# EAGLE design SIDEPANEL3.2test (EAGLE 7.3.0)
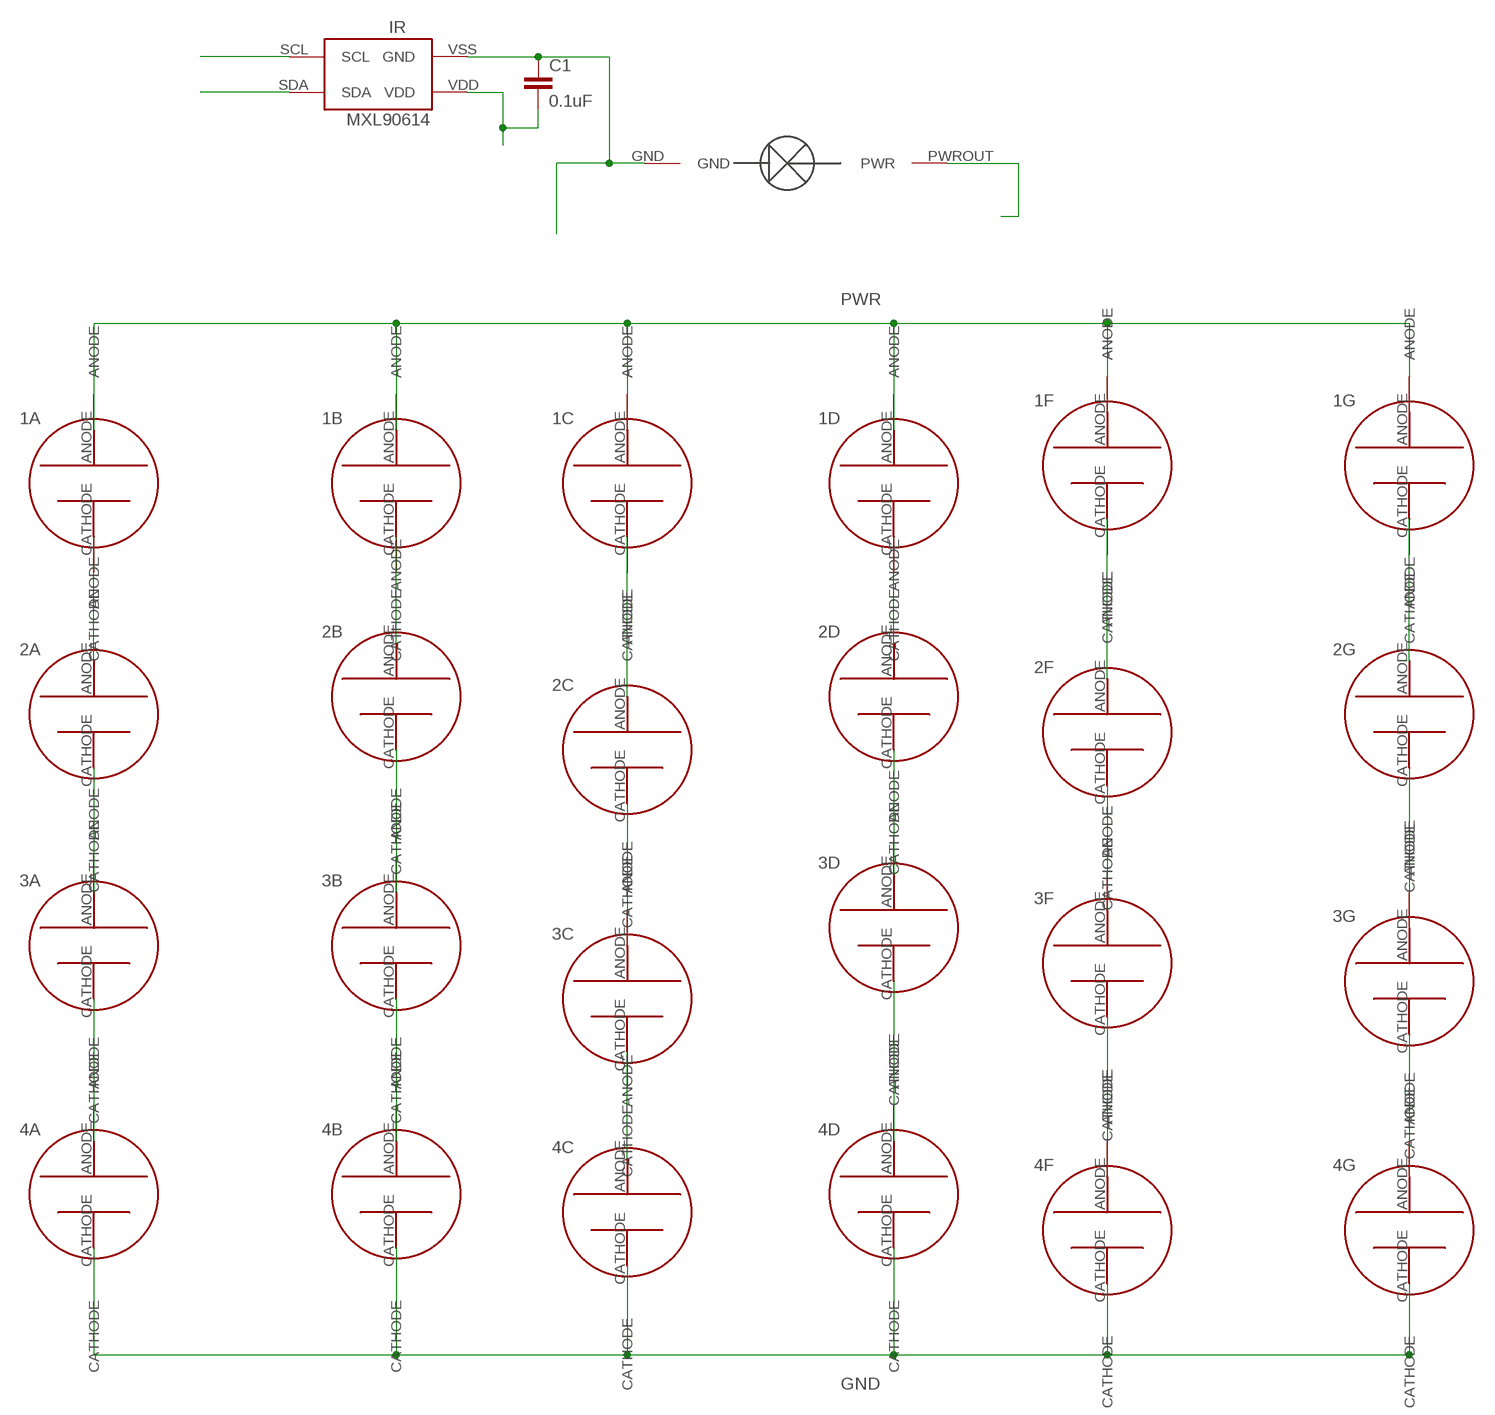
[diagram p0: schematic, sheet 1]

## Parts
1A  NEWSOLARPANEL  [SOLARCELL2]
1B  NEWSOLARPANEL  [SOLARCELL2]
1C  NEWSOLARPANEL  [SOLARCELL2]
1D  NEWSOLARPANEL  [SOLARCELL2]
1F  NEWSOLARPANEL  [SOLARCELL2]
1G  NEWSOLARPANEL  [SOLARCELL2]
2A  NEWSOLARPANEL  [SOLARCELL2]
2B  NEWSOLARPANEL  [SOLARCELL2]
2C  NEWSOLARPANEL  [SOLARCELL2]
2D  NEWSOLARPANEL  [SOLARCELL2]
2F  NEWSOLARPANEL  [SOLARCELL2]
2G  NEWSOLARPANEL  [SOLARCELL2]
3A  NEWSOLARPANEL  [SOLARCELL2]
3B  NEWSOLARPANEL  [SOLARCELL2]
3C  NEWSOLARPANEL  [SOLARCELL2]
3D  NEWSOLARPANEL  [SOLARCELL2]
3F  NEWSOLARPANEL  [SOLARCELL2]
3G  NEWSOLARPANEL  [SOLARCELL2]
4A  NEWSOLARPANEL  [SOLARCELL2]
4B  NEWSOLARPANEL  [SOLARCELL2]
4C  NEWSOLARPANEL  [SOLARCELL2]
4D  NEWSOLARPANEL  [SOLARCELL2]
4F  NEWSOLARPANEL  [SOLARCELL2]
4G  NEWSOLARPANEL  [SOLARCELL2]
C1  0.1uF  CAP0805  [0805]
IR  MXL90620  [MXL90614]
U$1  PHOTODETECTOR  [PHOTODECTORDEVICE2]

## Nets
3V3: C1.2 IR.VDD
GND: 4A.CATHODE 4B.CATHODE 4C.CATHODE 4D.CATHODE 4F.CATHODE 4G.CATHODE C1.1 IR.VSS(GND) U$1.GND
N$1: 2A.CATHODE 3A.ANODE
N$2: 1C.CATHODE 2C.ANODE
N$3: 2B.CATHODE 3B.ANODE
N$4: 2C.CATHODE 3C.ANODE
N$5: 2D.CATHODE 3D.ANODE
N$6: 3C.CATHODE 4C.ANODE
N$8: 2F.CATHODE 3F.ANODE
N$9: 1B.CATHODE 2B.ANODE
N$10: 2G.CATHODE 3G.ANODE
N$11: 3G.CATHODE 4G.ANODE
N$12: 1D.CATHODE 2D.ANODE
N$13: 3F.CATHODE 4F.ANODE
N$15: 3D.CATHODE 4D.ANODE
N$16: 3B.CATHODE 4B.ANODE
N$17: 3A.CATHODE 4A.ANODE
N$18: 1A.CATHODE 2A.ANODE
N$24: 1G.CATHODE 2G.ANODE
N$32: 1F.CATHODE 2F.ANODE
PDOUT: U$1.PWROUT(PWR)
PWR: 1A.ANODE 1B.ANODE 1C.ANODE 1D.ANODE 1F.ANODE 1G.ANODE
SCL: IR.SCL
SDA: IR.SDA

## Library data of the parts
1A 1B 1C 1D 1F 1G 2A 2B 2C 2D 2F 2G 3A 3B 3C 3D 3F 3G 4A 4B 4C 4D 4F 4G = solarcellnew:NEWSOLARPANEL
C1 = CNTRL_BOARD:CAP: Capacitor Standard 0603 ceramic capacitor, and 0.1" leaded capacitor.
IR = CNTRL_BOARD:MXL90620
U$1 = solarcellnew:PHOTODETECTOR

## Board
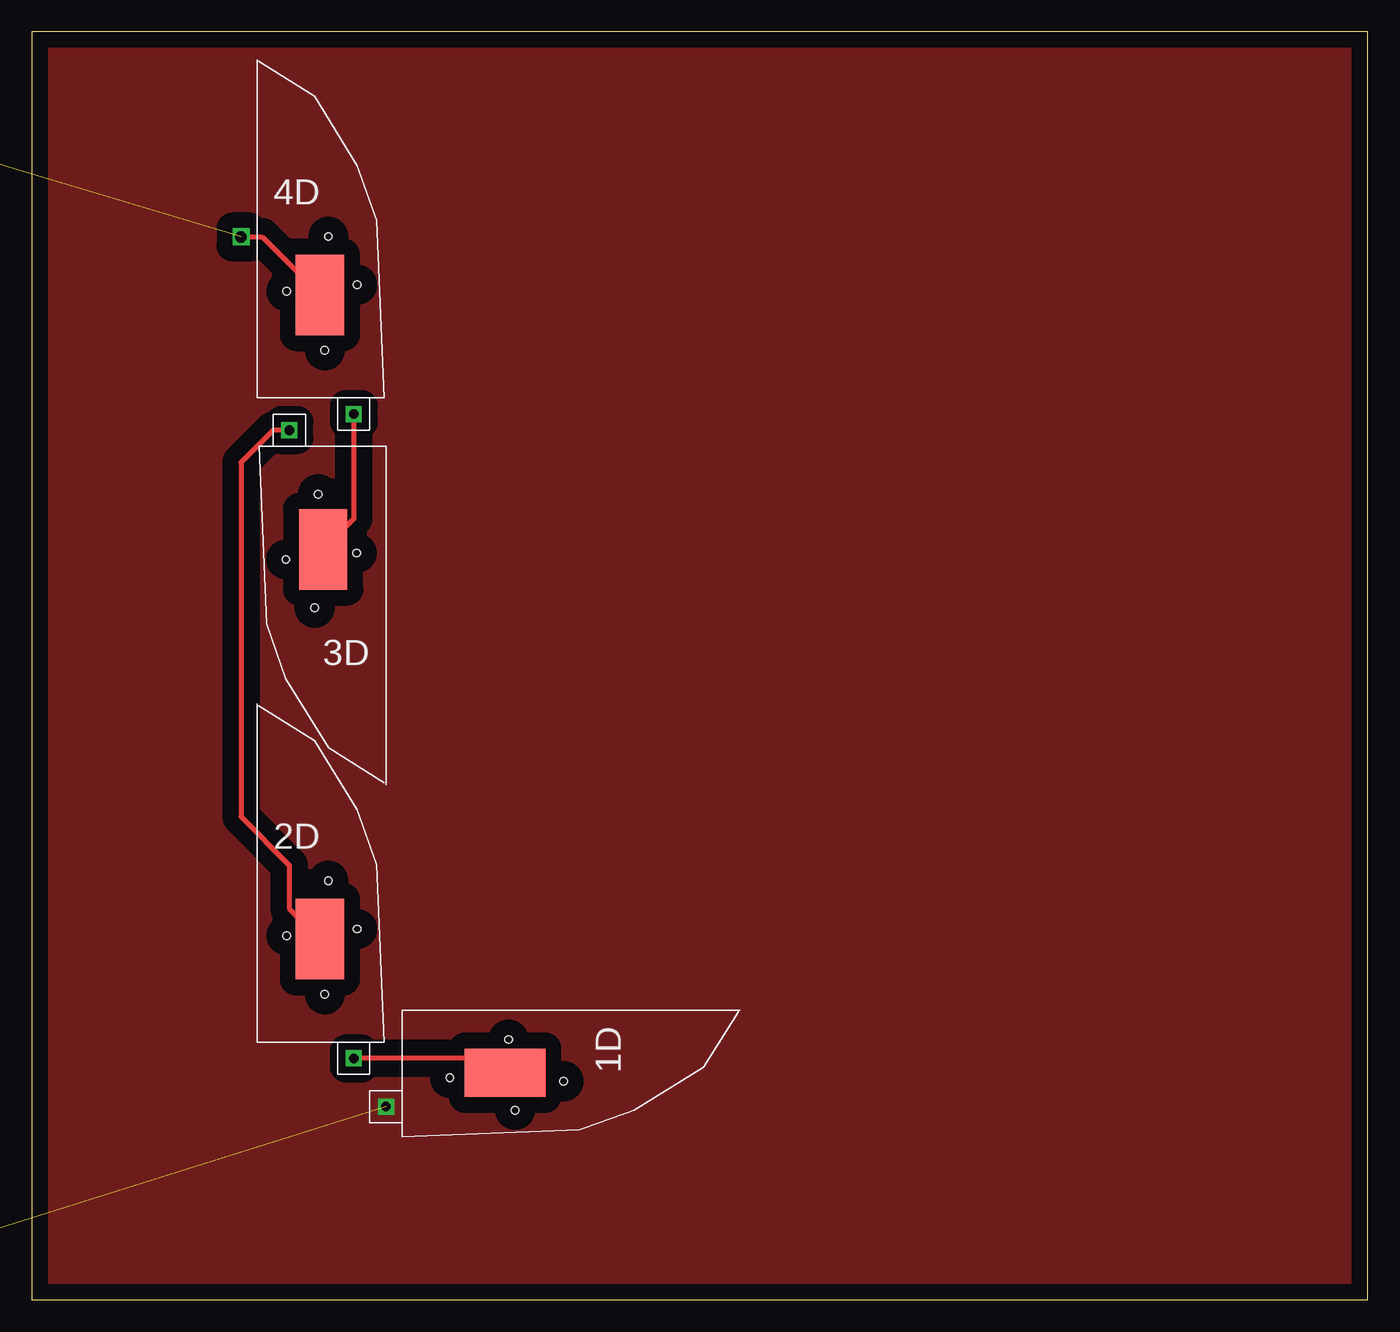
[diagram p1: board, top side]
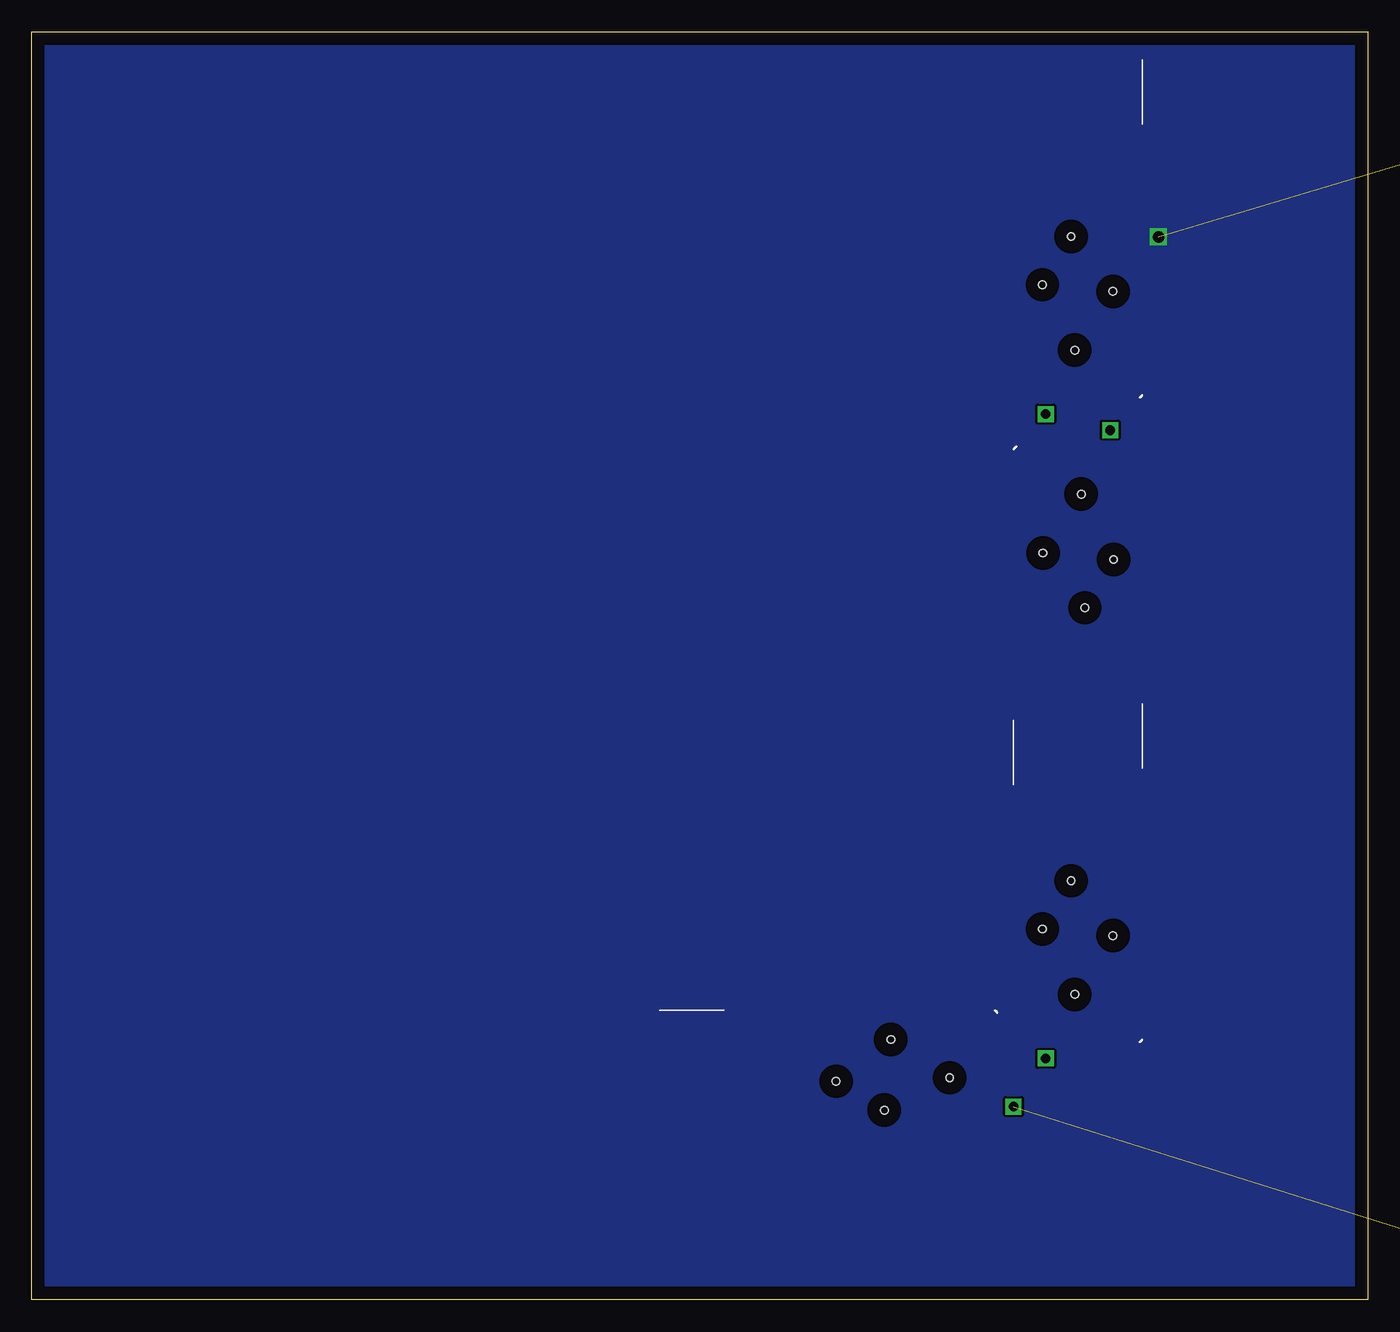
[diagram p2: board, bottom side, seen from below]

Size 105.39 x 100 mm. Coordinates in mm from the lower left corner, seen from the top.
Outline: 0,0 105.39,0 105.39,100 0,100 0,0
Copper layers (1*16): Top 0.035mm / dielectric 1.5mm / Bottom 0.035mm
Design rules "default": minimum track width 10mil, minimum drill 24mil, track to track 8mil, track to pad 8mil, pad to pad 8mil, via to via 8mil, smd to smd 8mil, copper to edge 40mil, drill to drill 8mil, minimum pad ring 10mil, minimum via ring 8mil, stop-mask expansion 4mil, vias tented up to drill 0mil, thermal gap 10mil

### Footprints (pad centres in the part's own frame; a part is rotated, then mirrored left to right if it is on the bottom)
SOLARCELL2 = drill 0.76 square: ANODE 7.62,-1.27 | smd 3.81 x 6.35: CATHODE 4.953,8.128 | hole 0.6: 2.32,8.41; 5.62,12.73; 7.89,8.93; 5.34,3.77
0805 = smd 0.8 x 1.2: 1 -0.9,0; 2 0.9,0
MXL90614 = drill 0.8: SCL 2.293,0; VDD -2.293,0; VSS 0,-2.294 | drill 0.8 pad 1.2: SDA 0,2.294
PHOTODECTORDEVICE2 = smd 1 x 1.45: GND 0.76,0.4; PWROUT -0.88,0.4

### Placement (x,y rotation side)
1A  -24.13,2.54 0 top  (outside the outline)
1B  -36.83,2.54 0 top  (outside the outline)
1C  -49.53,2.54 0 top  (outside the outline)
1D  29.21,22.86 270 top
1F  -74.93,2.54 0 top  (outside the outline)
1G  -87.63,2.54 0 top  (outside the outline)
2A  -100.33,2.54 0 top  (outside the outline)
2B  -24.13,31.75 0 top  (outside the outline)
2C  -36.83,31.75 0 top  (outside the outline)
2D  17.78,20.32 0 top
2F  -62.23,31.75 0 top  (outside the outline)
2G  -74.93,31.75 0 top  (outside the outline)
3A  -87.63,31.75 0 top  (outside the outline)
3B  -100.33,31.75 0 top  (outside the outline)
3C  -24.13,60.96 0 top  (outside the outline)
3D  27.94,67.31 180 top
3F  -49.53,60.96 0 top  (outside the outline)
3G  -62.23,60.96 0 top  (outside the outline)
4A  -74.93,60.96 0 top  (outside the outline)
4B  -87.63,60.96 0 top  (outside the outline)
4C  -100.33,60.96 0 top  (outside the outline)
4D  17.78,71.12 0 top
4F  -36.83,90.17 0 top  (outside the outline)
4G  -49.53,90.17 0 top  (outside the outline)
C1  -62.23,88.9 0 top  (outside the outline)
IR  -55.88,93.98 0 top  (outside the outline)
U$1  -66.04,88.9 0 top  (outside the outline)

### Tracks (layer width: path | path; a pad name or v marks a point on that pad's centre or on a via)
3V3  (1 unrouted)
GND  (via drill 0.9)  (8 unrouted)
  Top 0.406: v16.51,83.82 18.16,83.82 4D.CATHODE
  pour Bottom (no thermals): -6.35,106.68 170.18,106.68 170.18,-7.62 -6.35,-7.62
N$1  (1 unrouted)
N$2  (1 unrouted)
N$3  (1 unrouted)
N$4  (1 unrouted)
N$5
  Top 0.406: 3D.ANODE 19.05,68.58 16.51,66.04 16.51,38.1 20.32,34.29 20.32,30.86 2D.CATHODE
N$6  (1 unrouted)
N$8  (1 unrouted)
N$9  (1 unrouted)
N$10  (1 unrouted)
N$11  (1 unrouted)
N$12
  Top 0.406: 1D.CATHODE 36.7,17.91 35.56,19.05 2D.ANODE
N$13  (1 unrouted)
N$15
  Top 0.406: 4D.ANODE 25.4,61.59 3D.CATHODE
N$16  (1 unrouted)
N$17  (1 unrouted)
N$18  (1 unrouted)
N$24  (1 unrouted)
N$32  (1 unrouted)
PWR  (5 unrouted)
  pour Top (isolate 1.27, no thermals): -7.62,107.95 170.18,107.95 170.18,-10.16 -7.62,-10.16